# EAGLE design IPNS_v0.1 MCU (EAGLE 8.0.0)
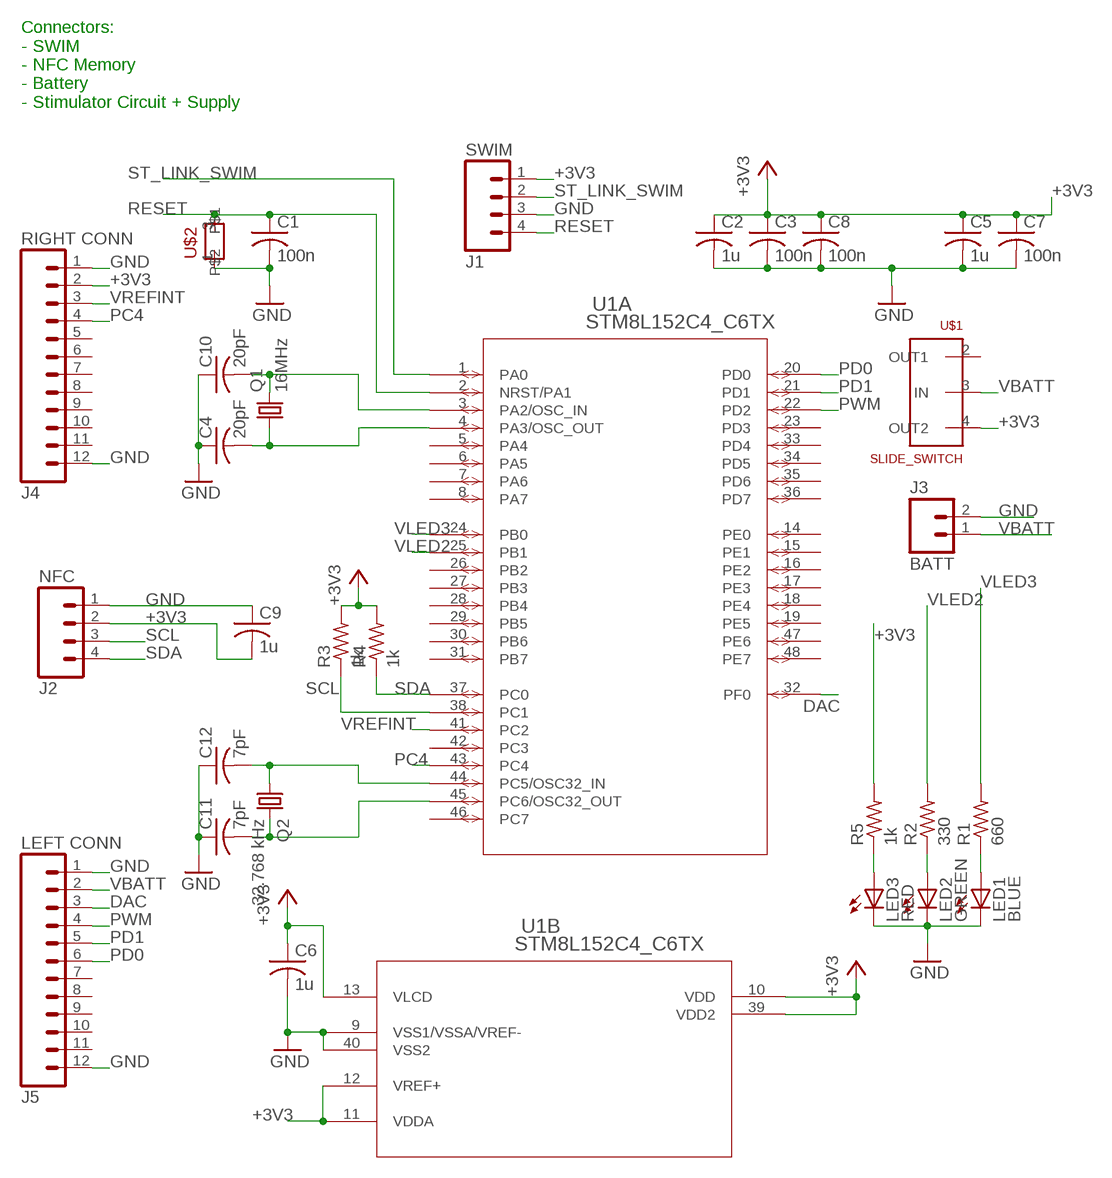
[diagram p0: schematic, sheet 1]

## Parts
C1  100n  C-USC0805  [C0805]
C2  1u  C-USC0805  [C0805]
C3  100n  C-USC0805  [C0805]
C4  20pF  C-USC0805  [C0805]
C5  1u  C-USC0805  [C0805]
C6  1u  C-USC0805  [C0805]
C7  100n  C-USC0805  [C0805]
C8  100n  C-USC0805  [C0805]
C9  1u  C-USC0805  [C0805]
C10  20pF  C-USC0805  [C0805]
C11  7pF  C-USC0805  [C0805]
C12  7pF  C-USC0805  [C0805]
J1  SWIM  M04PTH  [1X04]
J2  NFC  M04PTH  [1X04]
J3  BATT  M02PTH  [1X02]
J4  RIGHT CONN  M12PTH  [1X12]
J5  LEFT CONN  M12PTH  [1X12]
LED1  BLUE  LEDCHIP-LED0805  [CHIP-LED0805]
LED2  GREEN  LEDCHIP-LED0805  [CHIP-LED0805]
LED3  RED  LEDCHIP-LED0805  [CHIP-LED0805]
Q1  16MHz  CRYSTALHC49S  [HC49/S]
Q2  32.768 kHz  CRYSTALTC26H  [TC26H]
R1  660  R-US_R0805  [R0805]
R2  330  R-US_R0805  [R0805]
R3  1k  R-US_R0805  [R0805]
R4  1k  R-US_R0805  [R0805]
R5  1k  R-US_R0805  [R0805]
U1  STM8L152C4_C6TX  [LQFP48-7X7MM]
U$1  SLIDE_SWITCH  [SLIDE_SWITCH]
U$2  PUSH-BUTTON  [PUSH-BUTTON]

## Nets
+3V3: C2.1 C3.1 C5.1 C6.1 C7.1 C8.1 C9.2 J1.1 J2.2 J4.2 R3.2 R4.2 R5.2 U1.10(B:VDD) U1.11(B:VDDA) U1.12(B:VREF+) U1.13(B:VLCD) U1.39(B:VDD2) U$1.4(OUT2)
DAC: J5.3 U1.32(A:PF0)
GND: C1.2 C2.2 C3.2 C4.1 C5.2 C6.2 C7.2 C8.2 C9.1 C10.1 C11.1 C12.1 J1.3 J2.1 J3.2 J4.1 J4.12 J5.1 J5.12 LED1.C LED2.C LED3.C U1.9(B:VSS1/VSSA/VREF-) U1.40(B:VSS2) U$2.1
N$1: C10.2 Q1.2 U1.3(A:PA2/OSC_IN)
N$3: C11.2 Q2.2 U1.45(A:PC6/OSC32_OUT)
N$5: C4.2 Q1.1 U1.4(A:PA3/OSC_OUT)
N$6: C12.2 Q2.1 U1.44(A:PC5/OSC32_IN)
N$11: LED3.A R5.1
N$12: LED2.A R2.1
N$13: LED1.A R1.1
PC4: J4.4 U1.43(A:PC4)
PD0: J5.6 U1.20(A:PD0)
PD1: J5.5 U1.21(A:PD1)
PWM: J5.4 U1.22(A:PD2)
RESET: C1.1 J1.4 U1.2(A:NRST/PA1) U$2.3
SCL: J2.3 R3.1 U1.38(A:PC1)
SDA: J2.4 R4.1 U1.37(A:PC0)
ST_LINK_SWIM: J1.2 U1.1(A:PA0)
VBATT: J3.1 J5.2 U$1.3(IN)
VLED2: R2.2 U1.25(A:PB1)
VLED3: R1.2 U1.24(A:PB0)
VREFINT: J4.3 U1.41(A:PC2)
Unconnected: J4.5 J4.6 J4.7 J4.8 J4.9 J4.10 J4.11 J5.7 J5.8 J5.9 J5.10 J5.11 U1.5(A:PA4) U1.6(A:PA5) U1.7(A:PA6) U1.8(A:PA7) U1.14(A:PE0) U1.15(A:PE1) U1.16(A:PE2) U1.17(A:PE3) U1.18(A:PE4) U1.19(A:PE5) U1.23(A:PD3) U1.26(A:PB2) U1.27(A:PB3) U1.28(A:PB4) U1.29(A:PB5) U1.30(A:PB6) U1.31(A:PB7) U1.33(A:PD4) U1.34(A:PD5) U1.35(A:PD6) U1.36(A:PD7) U1.42(A:PC3) U1.46(A:PC7) U1.47(A:PE6) U1.48(A:PE7) U$1.2(OUT1)

## Notes on the sheet
- Connectors:
  - SWIM
  - NFC Memory
  - Battery
  - Stimulator Circuit + Supply

## Library data of the parts
C1-C12 = IPNS_Lib_v0.1:C-US: CAPACITOR, American symbol
J1 J2 = IPNS_Lib_v0.1:M04: Header 4 Standard 4-pin 0.1" header. Use with straight break away headers (SKU : PRT-00116), right angle break away headers (PRT-00553), swiss pins (PRT-00743), machine pins (PRT-00117), and female headers (PRT-00115). Molex polarized connector foot print use with SKU : PRT-08231 with associated crimp pins and housings. 1MM SMD Version SKU: PRT-10208; PROD_ID: CONN-09696
J3 = IPNS_Lib_v0.1:M02: Standard 2-pin 0.1" header. Use with - straight break away headers ( PRT-00116) - right angle break away headers (PRT-00553) - swiss pins (PRT-00743) - machine pins (PRT-00117) - female headers (PRT-00115) Molex polarized connector foot print use with: PRT-08233 with associated crimp pins and housings. 2.54_SCREWTERM for use with PRT-10571. 3.5mm Screw Terminal footprints for PRT-08084 5mm Screw Terminal footprints for use with PRT-08432
J4 J5 = IPNS_Lib_v0.1:M12: Header 12 Standard 12-pin 0.1" header. Use with straight break away headers (SKU : PRT-00116), right angle break away headers (PRT-00553), swiss pins (PRT-00743), machine pins (PRT-00117), and female headers (PRT-00115).
LED1-LED3 = led:LED: LED OSRAM: - CHIPLED LG R971, LG N971, LY N971, LG Q971, LY Q971, LO R971, LY R971 LH N974, LH R974 LS Q976, LO Q976, LY Q976 LO Q996 - Hyper CHIPLED LW Q18S LB Q993, LB Q99A, LB R99A - SideLED LS A670, LO A670, LY A670, LG A670, LP A670 LB A673, LV A673, LT A673, LW A673 LH A674 LY A675 LS A676, LA A676, LO A676, LY A676, LW A676 LS A679, LY A679, LG A679 - Hyper Micro SIDELED® LS Y876, LA Y876, LO Y876, LY Y876 LT Y87S - SmartLED LW L88C, LW L88S LB L89C, LB L89S, LG L890 LS L89K, LO L89K, LY L89K LS L896, LA L896, LO L896, LY L896 - TOPLED LS T670, LO T670, LY T670, LG T670, LP T670 LSG T670, LSP T670, LSY T670, LOP T670, LYG T670 LG T671, LOG T671, LSG T671 LB T673, LV T673, LT T673, LW T673 LH T674 LS T676, LA T676, LO T676, LY T676, LB T676, LH T676, LSB T676, LW T676 LB T67C, LV T67C, LT T67C, LS T67K, LO T67K, LY T67K, LW E67C LS E67B, LA E67B, LO E67B, LY E67B, LB E67C, LV E67C, LT E67C LW T67C LS T679, LY T679, LG T679 LS T770, LO T770, LY T770, LG T770, LP T770 LB T773, LV T773, LT T773, LW T773 LH T774 LS E675, LA E675, LY E675, LS T675 LS T776, LA T776, LO T776, LY T776, LB T776 LHGB T686 LT T68C, LB T68C - Hyper Mini TOPLED® LB M676 - Mini TOPLED Santana® LG M470 LS M47K, LO M47K, LY M47K Source: http://www.osram.convergy.de LUXEON: - LUMILED® LXK2-PW12-R00, LXK2-PW12-S00, LXK2-PW14-U00, LXK2-PW14-V00 LXK2-PM12-R00, LXK2-PM12-S00, LXK2-PM14-U00 LXK2-PE12-Q00, LXK2-PE12-R00, LXK2-PE12-S00, LXK2-PE14-T00, LXK2-PE14-U00 LXK2-PB12-K00, LXK2-PB12-L00, LXK2-PB12-M00, LXK2-PB14-N00, LXK2-PB14-P00, LXK2-PB14-Q00 LXK2-PR12-L00, LXK2-PR12-M00, LXK2-PR14-Q00, LXK2-PR14-R00 LXK2-PD12-Q00, LXK2-PD12-R00, LXK2-PD12-S00 LXK2-PH12-R00, LXK2-PH12-S00 LXK2-PL12-P00, LXK2-PL12-Q00, LXK2-PL12-R00 Source: www.luxeon.com KINGBRIGHT: KA-3528ASYC Source: www.kingbright.com
Q1 = IPNS_Lib_v0.1:CRYSTAL: CRYSTAL; OC_FARNELL: 1667008; OC_NEWARK: unknown
Q2 = IPNS_Lib_v0.1:CRYSTAL: CRYSTAL; OC_FARNELL: unknown; OC_NEWARK: unknown
R1-R5 = IPNS_Lib_v0.1:R-US_: RESISTOR, American symbol
U1 = IPNS_Lib_v0.1:STM8L152C4_C6TX; COPYRIGHT: Copyright (C) 2016 Accelerated Designs. All rights reserved; MANUFACTURER_PART_NUMBER: stm8l152c4_c6tx; VENDOR: ST Microelectronics
U$1 = IPNS_Lib_v0.1:SLIDE_SWITCH
U$2 = IPNS_Lib_v0.1:PUSH-BUTTON

## Net classes
0 default: width 0.152 mm, drill 0.305 mm, clearance 0.152 mm

## Board
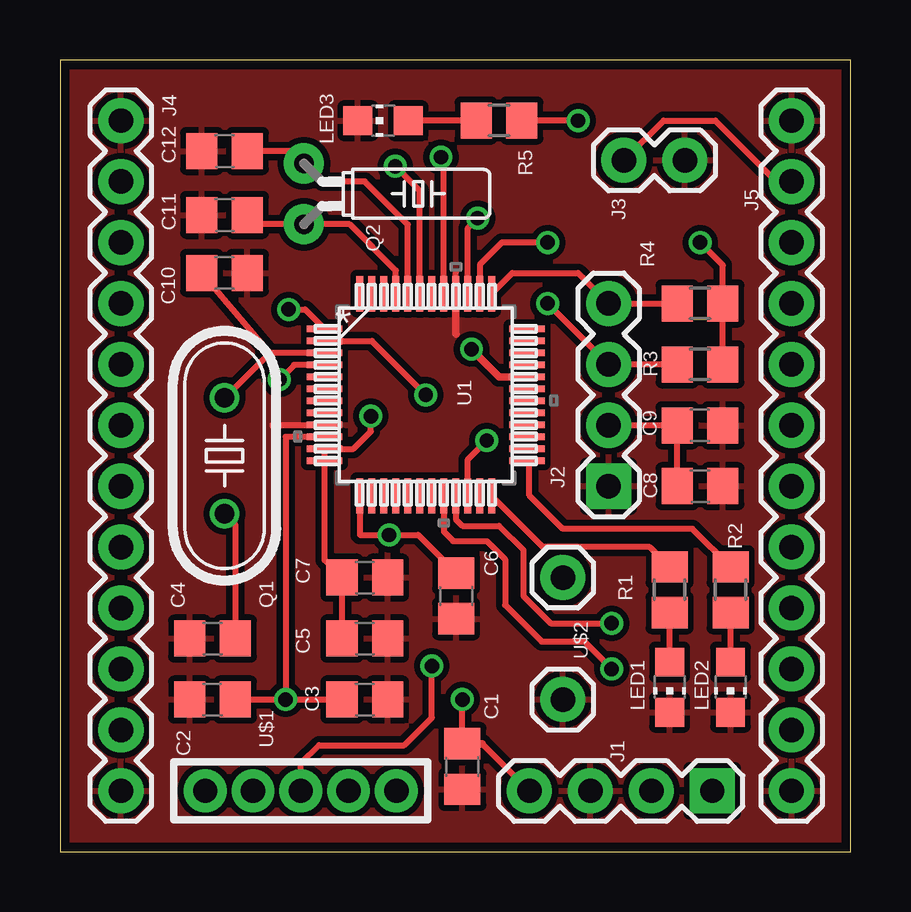
[diagram p1: board, top side]
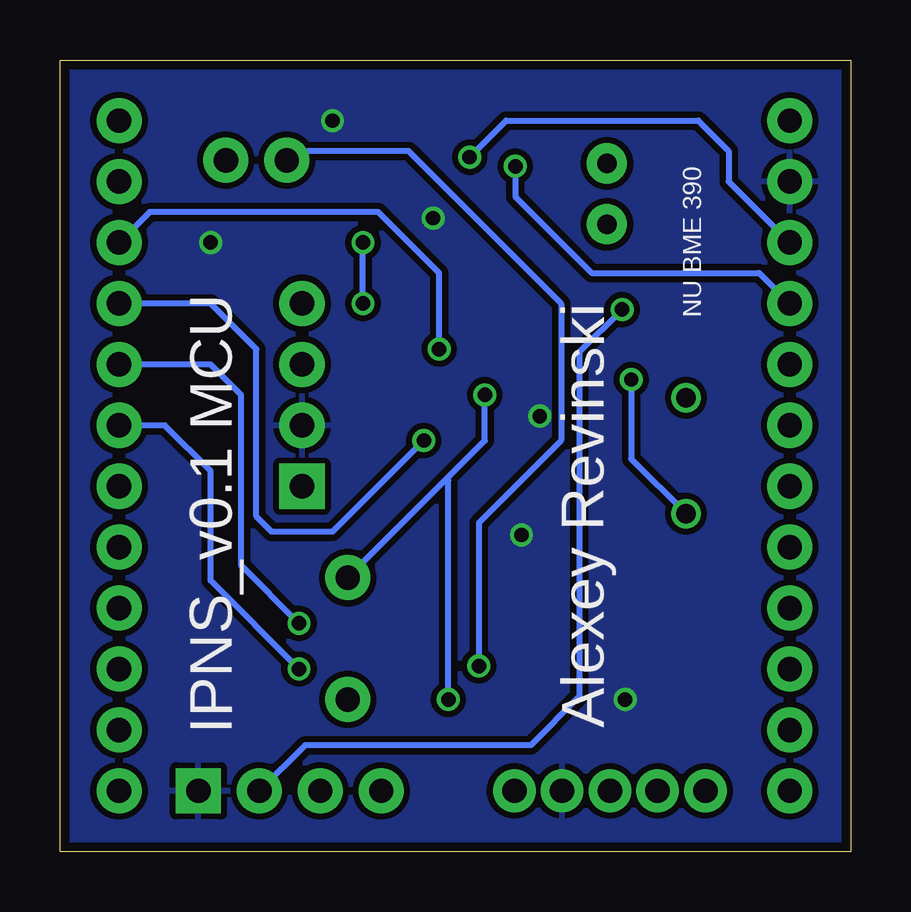
[diagram p2: board, bottom side, seen from below]

Size 32.94 x 33.01 mm. Coordinates in mm from the lower left corner, seen from the top.
Outline: 0,0 32.94,0 32.94,33.01 0,33.01 0,0
Copper layers (1*16): Top 0.0356mm / dielectric 1.5011mm / Bottom 0.0356mm
Design rules "Dorkbotpdx": minimum track width 6mil, minimum drill 13mil, track to track 6mil, track to pad 6mil, pad to pad 6mil, via to via 6mil, smd to smd 6mil, copper to edge 15mil, drill to drill 6mil, minimum pad ring 7mil, minimum via ring 7mil, stop-mask expansion 4mil, vias tented up to drill 0mil, thermal gap 10mil

### Footprints (pad centres in the part's own frame; a part is rotated, then mirrored left to right if it is on the bottom)
C0805 = smd 1.3 x 1.5: 1 -0.95,0; 2 0.95,0
1X04 = drill 1.016 pad 1.88 square: 1 0,0 | drill 1.016 pad 1.88: 2 2.54,0; 3 5.08,0; 4 7.62,0
1X02 = drill 1.016 pad 1.88: 1 0,0; 2 2.54,0
1X12 = drill 1.016 pad 1.88: 1 0,0; 2 2.54,0; 3 5.08,0; 4 7.62,0; 5 10.16,0; 6 12.7,0; 7 15.24,0; 8 17.78,0; 9 20.32,0; 10 22.86,0; 11 25.4,0; 12 27.94,0
CHIP-LED0805 = smd 1.2 x 1.2: A 0,-1.05; C 0,1.05
HC49/S = drill 0.813: 1 -2.413,0; 2 2.413,0
TC26H = drill 0.813 pad 1.676: 1 -1.27,0; 2 1.27,0
R0805 = smd 1.3 x 1.5: 1 -0.95,0; 2 0.95,0
LQFP48-7X7MM = smd 1.473 x 0.279: 1 -4.216,2.75; 2 -4.216,2.25; 3 -4.216,1.75; 4 -4.216,1.25; 5 -4.216,0.75; 6 -4.216,0.25; 7 -4.216,-0.25; 8 -4.216,-0.75; 9 -4.216,-1.25; 10 -4.216,-1.75; 11 -4.216,-2.25; 12 -4.216,-2.75; 25 4.216,-2.75; 26 4.216,-2.25; 27 4.216,-1.75; 28 4.216,-1.25; 29 4.216,-0.75; 30 4.216,-0.25; 31 4.216,0.25; 32 4.216,0.75; 33 4.216,1.25; 34 4.216,1.75; 35 4.216,2.25; 36 4.216,2.75 | smd 0.279 x 1.473: 13 -2.75,-4.216; 14 -2.25,-4.216; 15 -1.75,-4.216; 16 -1.25,-4.216; 17 -0.75,-4.216; 18 -0.25,-4.216; 19 0.25,-4.216; 20 0.75,-4.216; 21 1.25,-4.216; 22 1.75,-4.216; 23 2.25,-4.216; 24 2.75,-4.216; 37 2.75,4.216; 38 2.25,4.216; 39 1.75,4.216; 40 1.25,4.216; 41 0.75,4.216; 42 0.25,4.216; 43 -0.25,4.216; 44 -0.75,4.216; 45 -1.25,4.216; 46 -1.75,4.216; 47 -2.25,4.216; 48 -2.75,4.216
SLIDE_SWITCH = drill 1.016 pad 1.778: 1 -3.98,0; 2 -1.99,0; 3 0,0; 4 1.99,0; 5 3.98,0
PUSH-BUTTON = drill 1.016 pad 1.88: 1 -2.54,0; 3 2.54,0

### Placement (x,y rotation side)
C1  16.76,3.56 270 top
C2  6.35,6.35 180 top
C3  12.7,6.35 0 top
C4  6.35,8.89 0 top
C5  12.7,8.89 0 top
C6  16.51,10.67 270 top
C7  12.7,11.43 0 top
C8  26.67,15.24 0 top
C9  26.67,17.78 180 top
C10  6.86,24.13 180 top
C11  6.86,26.54 0 top
C12  6.86,29.21 0 top
J1  27.18,2.54 180 top
J2  22.86,15.24 90 top
J3  23.5,28.83 0 top
J4  2.54,30.48 270 top
J5  30.48,30.48 270 top
LED1  25.4,6.86 180 top
LED2  27.94,6.86 180 top
LED3  13.46,30.48 90 top
Q1  6.86,16.51 90 top
Q2  10.16,27.43 270 top
R1  25.4,10.92 90 top
R2  27.94,10.92 90 top
R3  26.67,20.32 0 top
R4  26.67,22.86 0 top
R5  18.29,30.48 0 top
U1  15.24,19.05 0 top
U$1  10.03,2.54 0 top
U$2  20.95,8.89 90 top

### Tracks (layer width: path | path; a pad name or v marks a point on that pad's centre or on a via)
+3V3  (via drill 0.6)
  Top 0.254: J2.2 C9.2 C8.1 | R3.2 R4.2 27.62,24.45 v26.67,25.4 | C2.1 v9.4,6.35 | U1.13 12.49,13.21 v13.72,13.21 14.92,13.21 C6.1 | C5.1 C7.1 11.02,12.16 U1.12 U1.11 12.23,16.8 12.95,17.53 v12.95,18.16 | U1.10 9.4,17.3 v9.4,6.35 | v9.4,6.35 C3.1 | U1.39 16.99,26.01 v17.4,26.42 | v21.59,30.48 R5.2
  pour Bottom (isolate 0.254): 0,33.02 0,0 33.02,0 33.02,33.02
DAC  (via drill 0.6)
  Top 0.305: U1.32 18.3,19.8 v17.14,20.95
  Bottom 0.254: v17.14,20.95 17.14,24.13 19.68,26.67 29.21,26.67 J5.3
GND
  Top 0.254: 8.89,17.8 U1.9 | U1.40 16.49,24.15
  Top 0.305: 8.89,17.8 8.89,17.78 | U1.40 16.49,21.61 16.51,21.59
  pour Top (isolate 0.254): 0,33.02 0,0 33.02,0 33.02,33.02
N$1
  Top 0.254: U1.3 8.73,20.8 Q1.2 | 8.73,20.8 C10.2
  Top 0.305: 8.73,20.8
N$3
  Top 0.254: U1.45 13.99,24.24 12.06,26.16 Q2.2 8.19,26.16
  Top 0.305: 8.19,26.16 C11.2
N$5  (via drill 0.6)
  Top 0.254: Q1.1 7.3,13.65 C4.2 | U1.4 9.76,20.3 v9.14,19.68
  Bottom 0.254: v9.14,19.68 9.14,16.38 Q1.1
N$6
  Top 0.254: U1.44 14.49,26.15 12.7,27.94 10.92,27.94 Q2.1 9.65,29.21 C12.2
N$11
  Top 0.254: R5.1 LED3.A
N$12
  Top 0.254: LED2.A R2.1
N$13
  Top 0.254: LED1.A R1.1
PC4  (via drill 0.6)
  Top 0.254: U1.43 14.99,27.55 v13.97,28.57
  Bottom 0.254: v13.97,28.57 13.97,27.3 10.79,24.13 3.81,24.13 J4.4
PD0  (via drill 0.6)
  Top 0.254: U1.20 15.99,13.35 16.38,12.95 17.78,12.95 18.54,12.19 18.54,10.29 20.07,8.76 21.84,8.76 v22.99,7.62
  Bottom 0.254: v22.99,7.62 26.67,11.3 26.67,15.88 28.57,17.78 J5.6
PD1  (via drill 0.6)
  Top 0.254: U1.21 16.49,13.86 16.76,13.59 18.29,13.59 19.3,12.57 19.3,10.67 20.45,9.53 v22.99,9.53
  Bottom 0.254: v22.99,9.53 25.4,11.94 25.4,19.05 26.67,20.32 J5.5
PWM  (via drill 0.6)
  Top 0.254: U1.22 16.99,16.36 v17.78,17.14
  Bottom 0.254: v17.78,17.14 21.59,13.34 24.13,13.34 24.77,13.97 24.77,20.95 26.67,22.86 J5.4
RESET  (via drill 0.6)
  Top 0.254: J1.4 17.59,4.51 | U1.2 12.99,21.3 v15.24,19.05 | C1.1 v16.76,6.35
  Top 0.305: 11.72,21.3 U1.2 | 17.59,4.51 C1.1
  Bottom 0.254: 16.83,15.56 U$2.3 | 16.83,15.56 15.24,17.14 v15.24,19.05 | v16.76,6.35 16.76,15.49 16.83,15.56
SCL  (via drill 0.6)
  Top 0.254: R3.1 J2.3 v20.32,22.86 | v20.32,25.4 18.41,25.4 17.49,24.48 U1.38
  Bottom 0.254: v20.32,22.86 v20.32,25.4
SDA
  Top 0.254: R4.1 J2.4 21.59,24.13 18.85,24.13 U1.37
ST_LINK_SWIM  (via drill 0.6)
  Top 0.254: v9.53,22.61 10.22,22.61 U1.1
  Bottom 0.254: J1.2 22.73,4.45 13.34,4.45 11.3,6.48 11.3,20.83 v9.53,22.61
VBATT  (via drill 0.6)
  Top 0.254: J3.1 25.15,30.48 27.3,30.48 29.84,27.94 J5.2 | U$1.3 10.03,3.68 10.79,4.45 14.35,4.45 15.49,5.59 v15.49,7.75
  Bottom 0.254: v15.49,7.75 15.49,13.72 12.06,17.14 12.06,22.86 18.41,29.21 22.61,29.21 23.11,28.83 J3.1
VLED2
  Top 0.254: R2.2 26.35,13.46 20.95,13.46 19.56,14.86 19.56,16.2 U1.25
VLED3
  Top 0.254: R1.2 24.57,12.7 20.12,12.7 U1.24
VREFINT  (via drill 0.6)
  Top 0.254: U1.41 15.99,28.84 v15.88,28.96
  Bottom 0.254: 15.88,28.57 v15.88,28.96 14.35,30.48 6.35,30.48 5.08,29.21 5.08,27.94 J4.3

### Text on the board
bPlace: NU BME 390 | Alexey Revinski | IPNS_v0.1 MCU